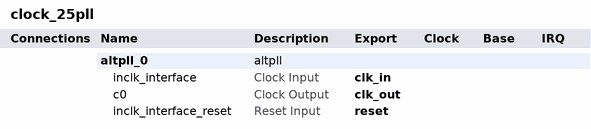
[diagram p0: system contents]
# Platform Designer (Qsys) system clock_25pll, Cyclone IV E EP4CE115F29C8
# Parameters at their usual value, and those the tool derives, are not listed.
package require qsys
create_system clock_25pll
set_project_property DEVICE_FAMILY {Cyclone IV E}
set_project_property DEVICE EP4CE115F29C8

add_instance altpll_0 altpll 13.0
set_instance_parameter_value altpll_0 INCLK0_INPUT_FREQUENCY 20000
set_instance_parameter_value altpll_0 CLK0_MULTIPLY_BY 1007
set_instance_parameter_value altpll_0 CLK0_DIVIDE_BY 2000
set_instance_parameter_value altpll_0 PORT_clk1 PORT_UNUSED
set_instance_parameter_value altpll_0 PORT_clk2 PORT_UNUSED
set_instance_parameter_value altpll_0 PORT_clk3 PORT_UNUSED
set_instance_parameter_value altpll_0 PORT_ARESET PORT_UNUSED
set_instance_parameter_value altpll_0 PORT_LOCKED PORT_UNUSED

# exported interfaces
add_interface clk_in clock sink
set_interface_property clk_in EXPORT_OF altpll_0.inclk_interface
add_interface reset reset sink
set_interface_property reset EXPORT_OF altpll_0.inclk_interface_reset
add_interface clk_out clock source
set_interface_property clk_out EXPORT_OF altpll_0.c0

set_interconnect_requirement {$system} qsys_mm.clockCrossingAdapter HANDSHAKE
set_interconnect_requirement {$system} qsys_mm.maxAdditionalLatency 1

save_system clock_25pll.qsys
